# EAGLE design tiny_rack_v2_psu_exp_170 (EAGLE 9.6.2)

## Sheet 1 of 3
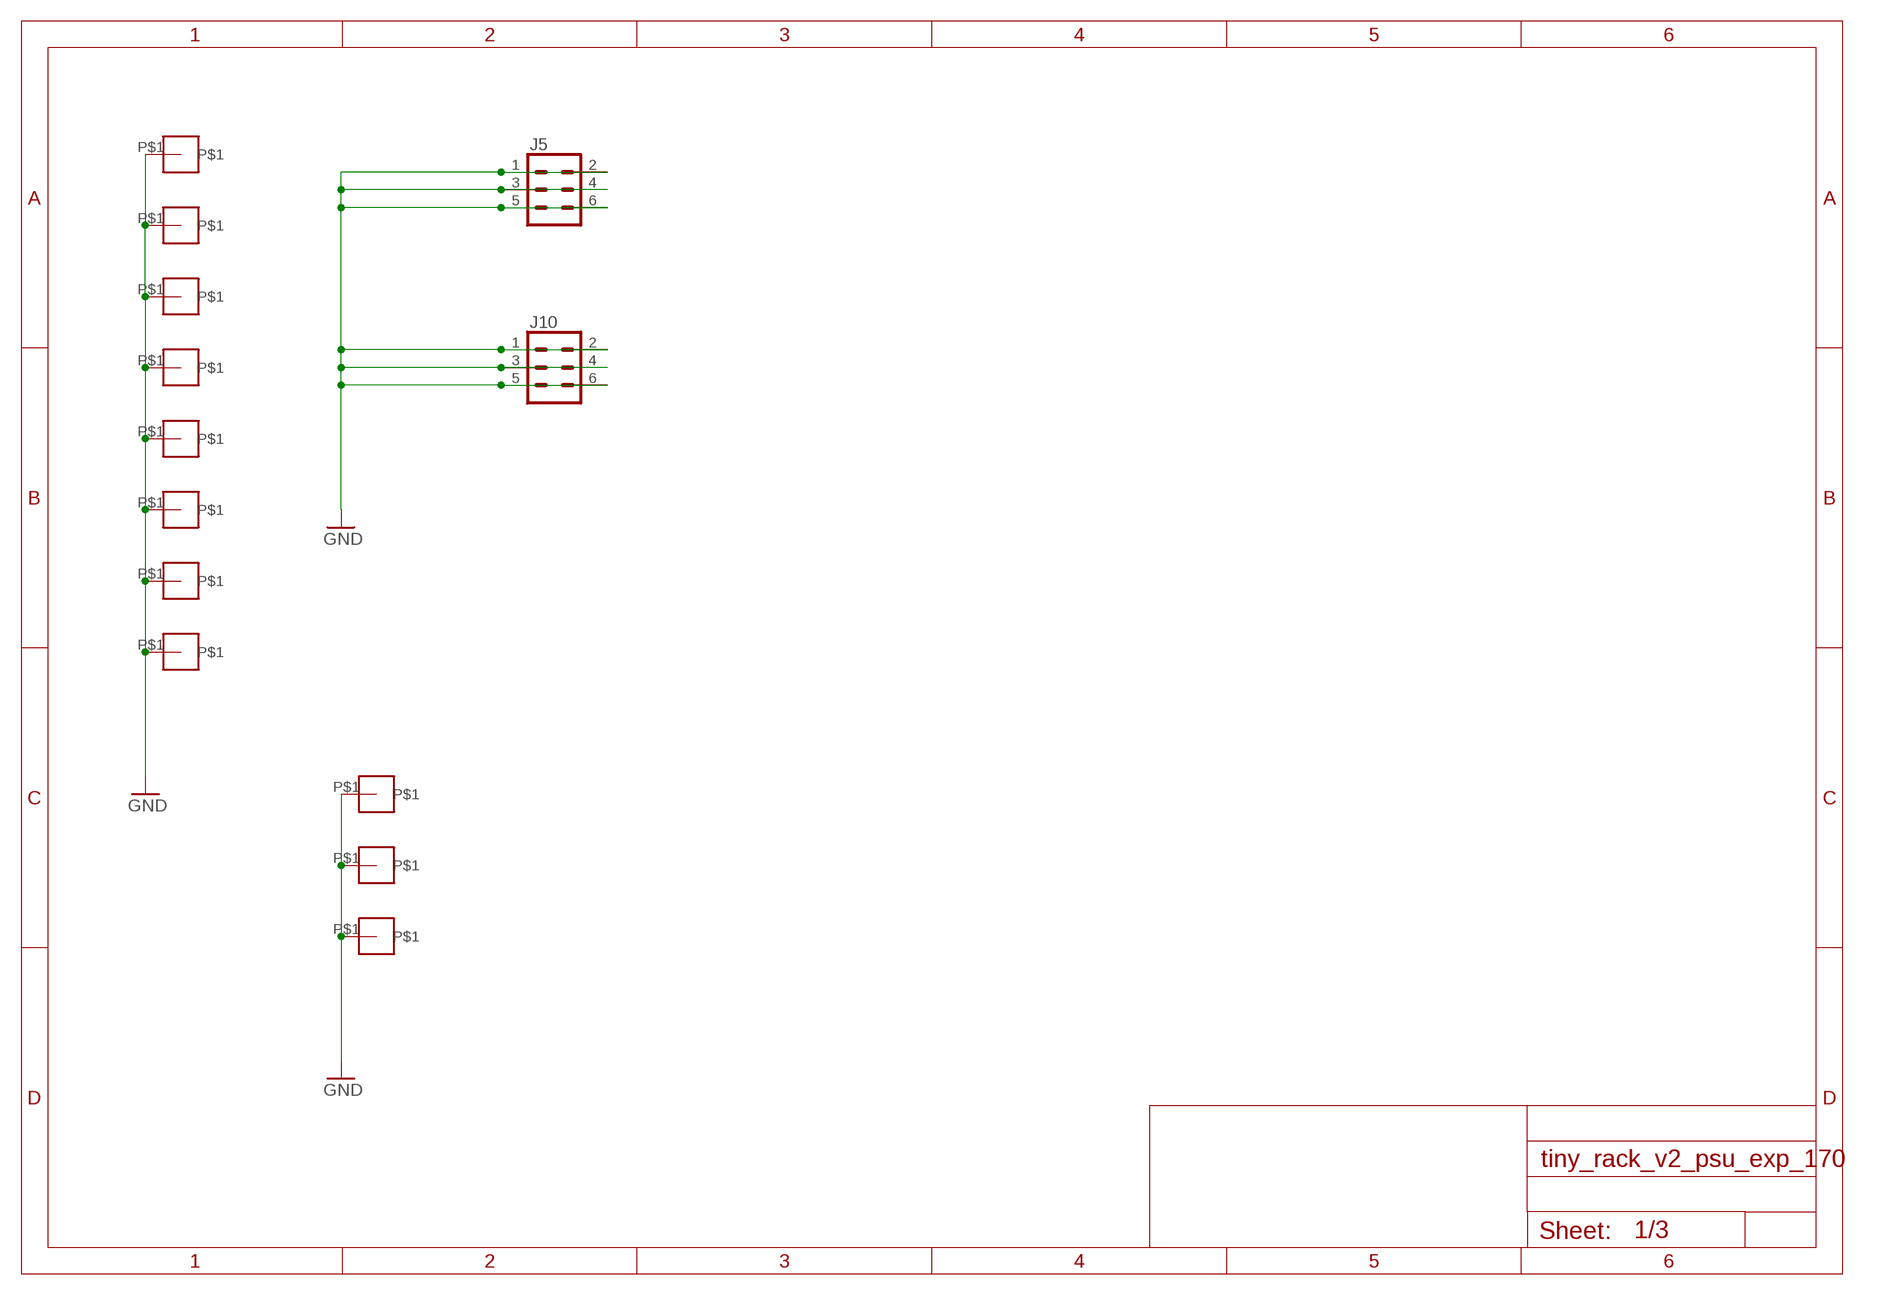
[diagram p0: schematic, sheet 1]

### Parts
J5  CONN_03X2FEMALE_SMD  [2X3_SMD]
J10  CONN_03X2FEMALE_SMD  [2X3_SMD]
U$1  M3-HOLE  [M3-HOLE]
U$2  M3-HOLE  [M3-HOLE]
U$3  M3-HOLE  [M3-HOLE]
U$4  M3-HOLE  [M3-HOLE]
U$5  M3-HOLE  [M3-HOLE]
U$6  M3-HOLE  [M3-HOLE]
U$8  M3-HOLE  [M3-HOLE]
U$9  M3-HOLE  [M3-HOLE]
U$10  M3-HOLE  [M3-HOLE]
U$11  M3-HOLE  [M3-HOLE]
U$12  M3-HOLE  [M3-HOLE]

### Nets
GND: J5.1 J5.2 J5.3 J5.4 J5.5 J5.6 J10.1 J10.2 J10.3 J10.4 J10.5 J10.6 U$1.P$1 U$2.P$1 U$3.P$1 U$4.P$1 U$5.P$1 U$6.P$1 U$8.P$1 U$9.P$1 U$10.P$1 U$11.P$1 U$12.P$1 ; also sheet 2,3

## Sheet 2 of 3
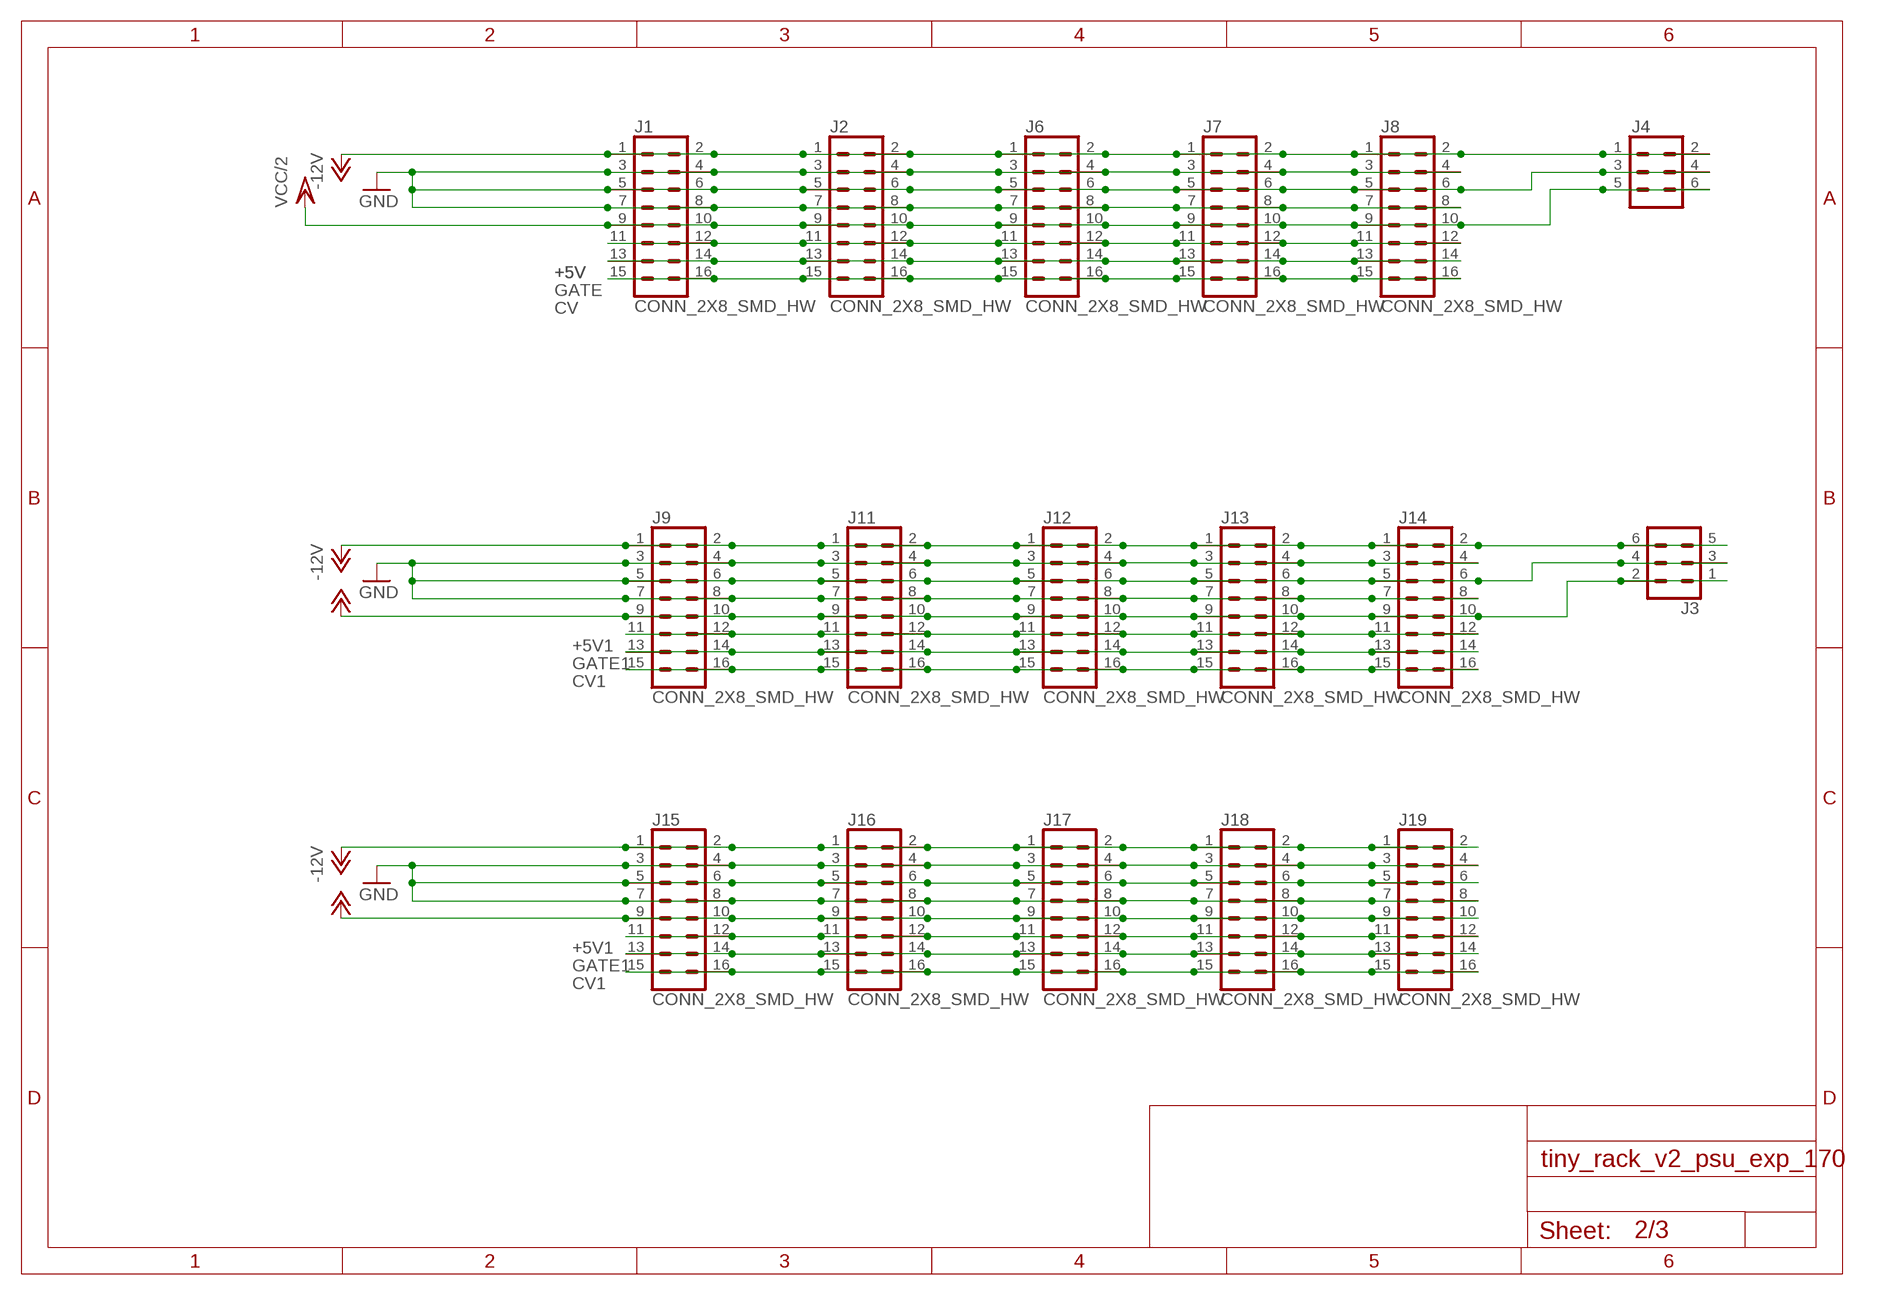
[diagram p1: schematic, sheet 2]

### Parts
J1  CONN_2X8_SMD_HW  [2X8-SHROUDED_SMD_HW]
J2  CONN_2X8_SMD_HW  [2X8-SHROUDED_SMD_HW]
J3  CONN_03X2FEMALE_SMD  [2X3_SMD]
J4  CONN_03X2FEMALE_SMD  [2X3_SMD]
J6  CONN_2X8_SMD_HW  [2X8-SHROUDED_SMD_HW]
J7  CONN_2X8_SMD_HW  [2X8-SHROUDED_SMD_HW]
J8  CONN_2X8_SMD_HW  [2X8-SHROUDED_SMD_HW]
J9  CONN_2X8_SMD_HW  [2X8-SHROUDED_SMD_HW]
J11  CONN_2X8_SMD_HW  [2X8-SHROUDED_SMD_HW]
J12  CONN_2X8_SMD_HW  [2X8-SHROUDED_SMD_HW]
J13  CONN_2X8_SMD_HW  [2X8-SHROUDED_SMD_HW]
J14  CONN_2X8_SMD_HW  [2X8-SHROUDED_SMD_HW]
J15  CONN_2X8_SMD_HW  [2X8-SHROUDED_SMD_HW]
J16  CONN_2X8_SMD_HW  [2X8-SHROUDED_SMD_HW]
J17  CONN_2X8_SMD_HW  [2X8-SHROUDED_SMD_HW]
J18  CONN_2X8_SMD_HW  [2X8-SHROUDED_SMD_HW]
J19  CONN_2X8_SMD_HW  [2X8-SHROUDED_SMD_HW]

### Nets
+5V: J1.11 J1.12 J2.11 J2.12 J6.11 J6.12 J7.11 J7.12 J8.11 J8.12 ; also sheet 3
+5V1: J9.11 J9.12 J11.11 J11.12 J12.11 J12.12 J13.11 J13.12 J14.11 J14.12 J15.11 J15.12 J16.11 J16.12 J17.11 J17.12 J18.11 J18.12 J19.11 J19.12 ; also sheet 3
+12V: J3.1 J3.2 J9.9 J9.10 J11.9 J11.10 J12.9 J12.10 J13.9 J13.10 J14.9 J14.10 J15.9 J15.10 J16.9 J16.10 J17.9 J17.10 J18.9 J18.10 J19.9 J19.10 ; also sheet 3
-12V: J1.1 J1.2 J2.1 J2.2 J3.5 J3.6 J4.1 J4.2 J6.1 J6.2 J7.1 J7.2 J8.1 J8.2 J9.1 J9.2 J11.1 J11.2 J12.1 J12.2 J13.1 J13.2 J14.1 J14.2 J15.1 J15.2 J16.1 J16.2 J17.1 J17.2 J18.1 J18.2 J19.1 J19.2 ; also sheet 3
CV: J1.15 J1.16 J2.15 J2.16 J6.15 J6.16 J7.15 J7.16 J8.15 J8.16 ; also sheet 3
CV1: J9.15 J9.16 J11.15 J11.16 J12.15 J12.16 J13.15 J13.16 J14.15 J14.16 J15.15 J15.16 J16.15 J16.16 J17.15 J17.16 J18.15 J18.16 J19.15 J19.16 ; also sheet 3
GATE: J1.13 J1.14 J2.13 J2.14 J6.13 J6.14 J7.13 J7.14 J8.13 J8.14 ; also sheet 3
GATE1: J9.13 J9.14 J11.13 J11.14 J12.13 J12.14 J13.13 J13.14 J14.13 J14.14 J15.13 J15.14 J16.13 J16.14 J17.13 J17.14 J18.13 J18.14 J19.13 J19.14 ; also sheet 3
GND: J1.3 J1.4 J1.5 J1.6 J1.7 J1.8 J2.3 J2.4 J2.5 J2.6 J2.7 J2.8 J3.3 J3.4 J4.3 J4.4 J6.3 J6.4 J6.5 J6.6 J6.7 J6.8 J7.3 J7.4 J7.5 J7.6 J7.7 J7.8 J8.3 J8.4 J8.5 J8.6 J8.7 J8.8 J9.3 J9.4 J9.5 J9.6 J9.7 J9.8 J11.3 J11.4 J11.5 J11.6 J11.7 J11.8 J12.3 J12.4 J12.5 J12.6 J12.7 J12.8 J13.3 J13.4 J13.5 J13.6 J13.7 J13.8 J14.3 J14.4 J14.5 J14.6 J14.7 J14.8 J15.3 J15.4 J15.5 J15.6 J15.7 J15.8 J16.3 J16.4 J16.5 J16.6 J16.7 J16.8 J17.3 J17.4 J17.5 J17.6 J17.7 J17.8 J18.3 J18.4 J18.5 J18.6 J18.7 J18.8 J19.3 J19.4 J19.5 J19.6 J19.7 J19.8 ; also sheet 1,3
VCC/2: J1.9 J1.10 J2.9 J2.10 J4.5 J4.6 J6.9 J6.10 J7.9 J7.10 J8.9 J8.10 ; also sheet 3

## Sheet 3 of 3
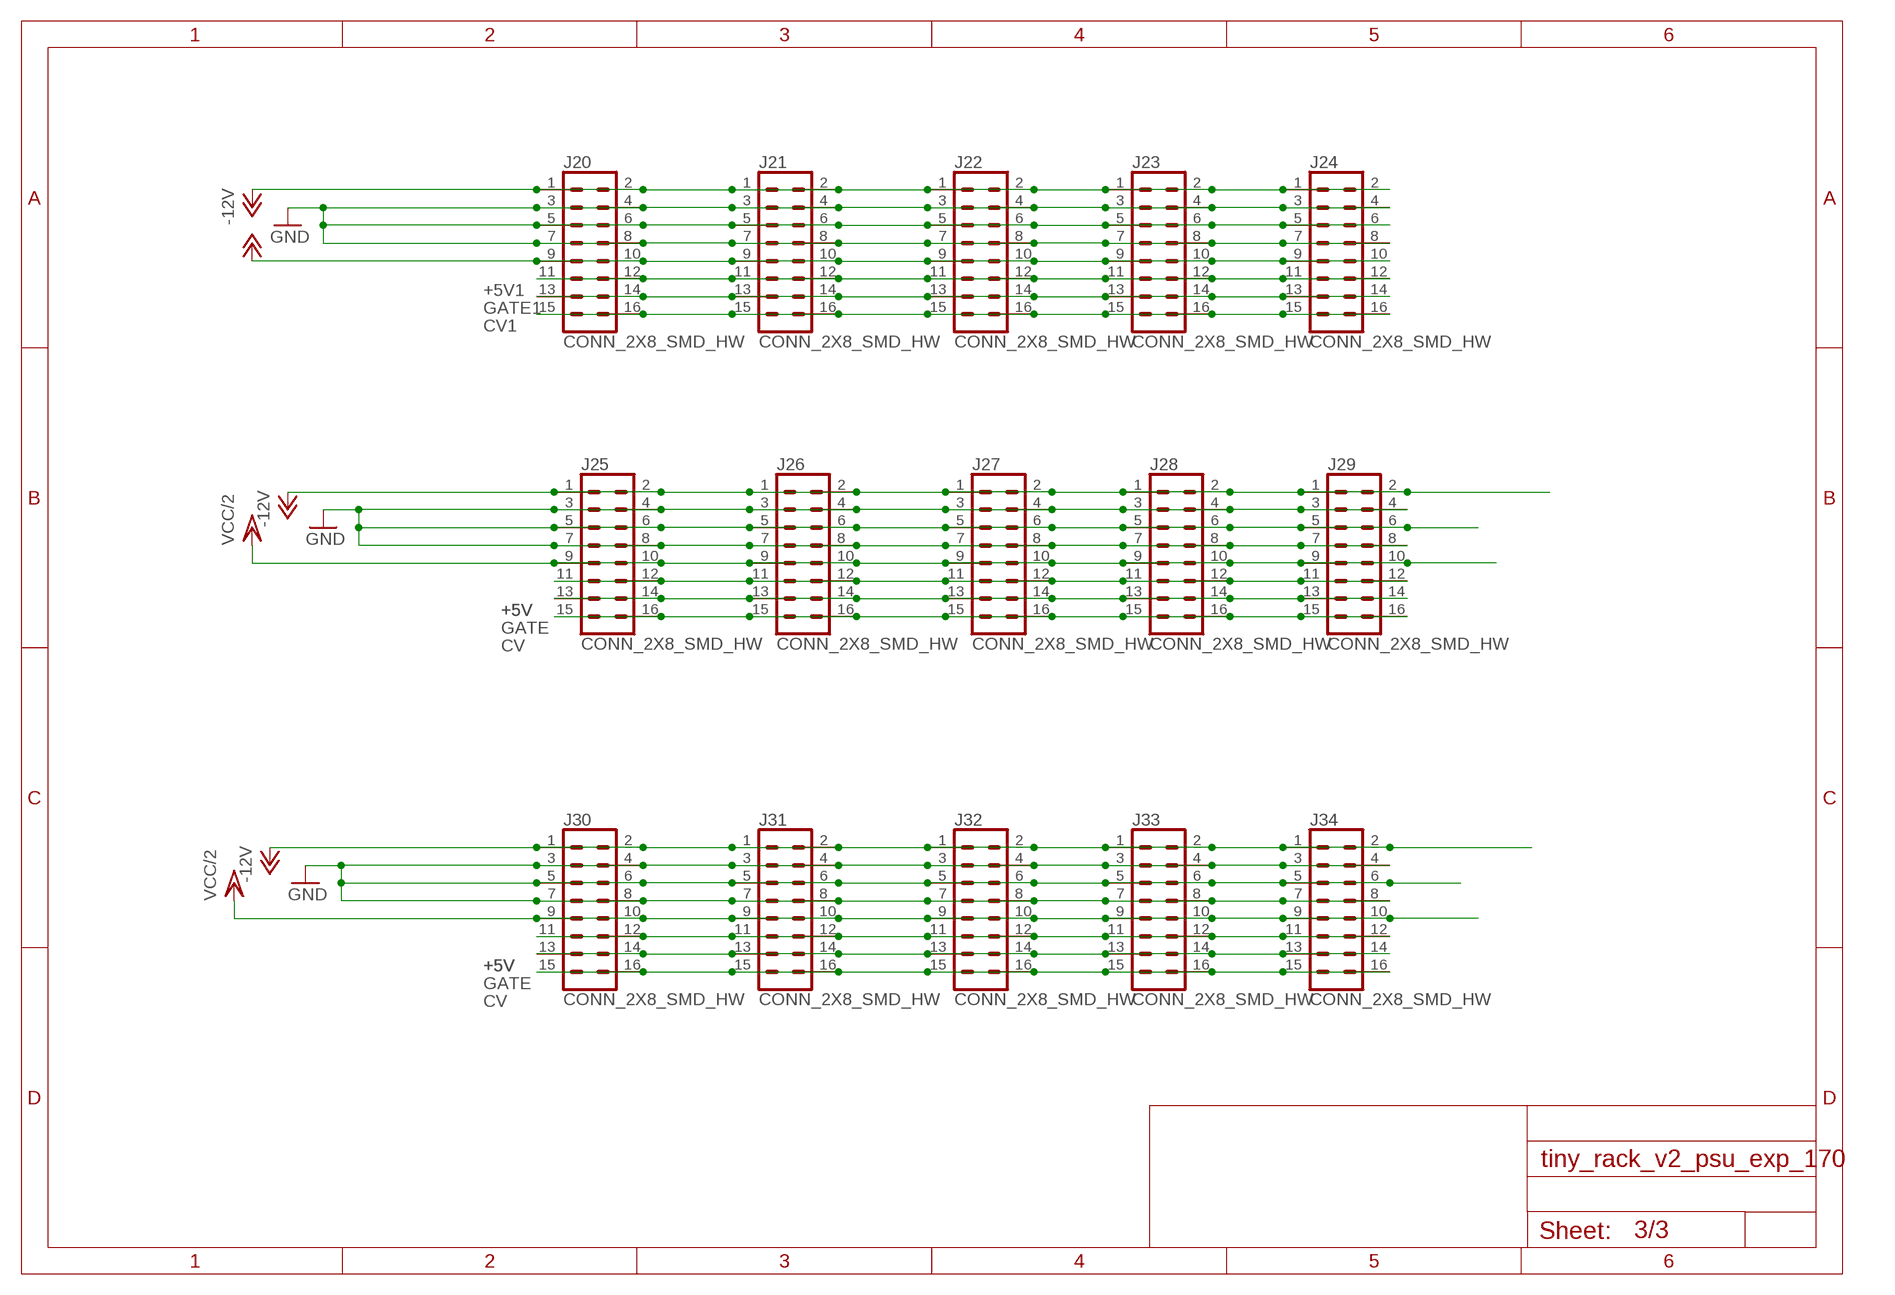
[diagram p2: schematic, sheet 3]

### Parts
J20  CONN_2X8_SMD_HW  [2X8-SHROUDED_SMD_HW]
J21  CONN_2X8_SMD_HW  [2X8-SHROUDED_SMD_HW]
J22  CONN_2X8_SMD_HW  [2X8-SHROUDED_SMD_HW]
J23  CONN_2X8_SMD_HW  [2X8-SHROUDED_SMD_HW]
J24  CONN_2X8_SMD_HW  [2X8-SHROUDED_SMD_HW]
J25  CONN_2X8_SMD_HW  [2X8-SHROUDED_SMD_HW]
J26  CONN_2X8_SMD_HW  [2X8-SHROUDED_SMD_HW]
J27  CONN_2X8_SMD_HW  [2X8-SHROUDED_SMD_HW]
J28  CONN_2X8_SMD_HW  [2X8-SHROUDED_SMD_HW]
J29  CONN_2X8_SMD_HW  [2X8-SHROUDED_SMD_HW]
J30  CONN_2X8_SMD_HW  [2X8-SHROUDED_SMD_HW]
J31  CONN_2X8_SMD_HW  [2X8-SHROUDED_SMD_HW]
J32  CONN_2X8_SMD_HW  [2X8-SHROUDED_SMD_HW]
J33  CONN_2X8_SMD_HW  [2X8-SHROUDED_SMD_HW]
J34  CONN_2X8_SMD_HW  [2X8-SHROUDED_SMD_HW]

### Nets
+5V: J25.11 J25.12 J26.11 J26.12 J27.11 J27.12 J28.11 J28.12 J29.11 J29.12 J30.11 J30.12 J31.11 J31.12 J32.11 J32.12 J33.11 J33.12 J34.11 J34.12 ; also sheet 2
+5V1: J20.11 J20.12 J21.11 J21.12 J22.11 J22.12 J23.11 J23.12 J24.11 J24.12 ; also sheet 2
+12V: J20.9 J20.10 J21.9 J21.10 J22.9 J22.10 J23.9 J23.10 J24.9 J24.10 ; also sheet 2
-12V: J20.1 J20.2 J21.1 J21.2 J22.1 J22.2 J23.1 J23.2 J24.1 J24.2 J25.1 J25.2 J26.1 J26.2 J27.1 J27.2 J28.1 J28.2 J29.1 J29.2 J30.1 J30.2 J31.1 J31.2 J32.1 J32.2 J33.1 J33.2 J34.1 J34.2 ; also sheet 2
CV: J25.15 J25.16 J26.15 J26.16 J27.15 J27.16 J28.15 J28.16 J29.15 J29.16 J30.15 J30.16 J31.15 J31.16 J32.15 J32.16 J33.15 J33.16 J34.15 J34.16 ; also sheet 2
CV1: J20.15 J20.16 J21.15 J21.16 J22.15 J22.16 J23.15 J23.16 J24.15 J24.16 ; also sheet 2
GATE: J25.13 J25.14 J26.13 J26.14 J27.13 J27.14 J28.13 J28.14 J29.13 J29.14 J30.13 J30.14 J31.13 J31.14 J32.13 J32.14 J33.13 J33.14 J34.13 J34.14 ; also sheet 2
GATE1: J20.13 J20.14 J21.13 J21.14 J22.13 J22.14 J23.13 J23.14 J24.13 J24.14 ; also sheet 2
GND: J20.3 J20.4 J20.5 J20.6 J20.7 J20.8 J21.3 J21.4 J21.5 J21.6 J21.7 J21.8 J22.3 J22.4 J22.5 J22.6 J22.7 J22.8 J23.3 J23.4 J23.5 J23.6 J23.7 J23.8 J24.3 J24.4 J24.5 J24.6 J24.7 J24.8 J25.3 J25.4 J25.5 J25.6 J25.7 J25.8 J26.3 J26.4 J26.5 J26.6 J26.7 J26.8 J27.3 J27.4 J27.5 J27.6 J27.7 J27.8 J28.3 J28.4 J28.5 J28.6 J28.7 J28.8 J29.3 J29.4 J29.5 J29.6 J29.7 J29.8 J30.3 J30.4 J30.5 J30.6 J30.7 J30.8 J31.3 J31.4 J31.5 J31.6 J31.7 J31.8 J32.3 J32.4 J32.5 J32.6 J32.7 J32.8 J33.3 J33.4 J33.5 J33.6 J33.7 J33.8 J34.3 J34.4 J34.5 J34.6 J34.7 J34.8 ; also sheet 1,2
VCC/2: J25.9 J25.10 J26.9 J26.10 J27.9 J27.10 J28.9 J28.10 J29.9 J29.10 J30.9 J30.10 J31.9 J31.10 J32.9 J32.10 J33.9 J33.10 J34.9 J34.10 ; also sheet 2

## Library data of the parts
J1 J2 J6-J9 J11-J34 = conn-fc:CONN_2X8_SMD_HW
J3-J5 J10 = SparkFun-Connectors:CONN_03X2: Multi connection point. Often used as Generic Header-pin footprint for 0.1 inch spaced/style header connections You can populate with any combo of single row headers, but if you'd like an exact match, check these: Header - 2x3 (Male, 0.1") <https://www.sparkfun.com/products/12807> (PRT-12807) Header - 2x3 (Female, 0.1") <https://www.sparkfun.com/products/13010> (PRT-13010) 2x3 Pin Shrouded Header <https://www.sparkfun.com/products/10877> (PRT-10877) On any of the 0.1 inch spaced packages, you can populate with these: Break Away Headers - Straight <https://www.sparkfun.com/products/116> (PRT-00116) Break Away Male Headers - Right Angle <https://www.sparkfun.com/products/553> (PRT-00553) Female Headers <https://www.sparkfun.com/products/115> (PRT-00115) Break Away Headers - Machine Pin <https://www.sparkfun.com/products/117> (PRT-00117) Break Away Female Headers - Swiss Machine Pin <https://www.sparkfun.com/products/743> (PRT-00743) Special note: the shrouded connector mates well with our 3x2 ribbon cables: Ribbon Crimp Connector - 6-pin (2x3, Female) <https://www.sparkfun.com/products/10651> (PRT-10651) Ribbon Cable - 6 wire (15ft) <https://www.sparkfun.com/products/10646> (PRT-10646); PROD_ID: CONN-11290
U$1-U$6 U$8-U$12 = biti:M3-HOLE

## Board
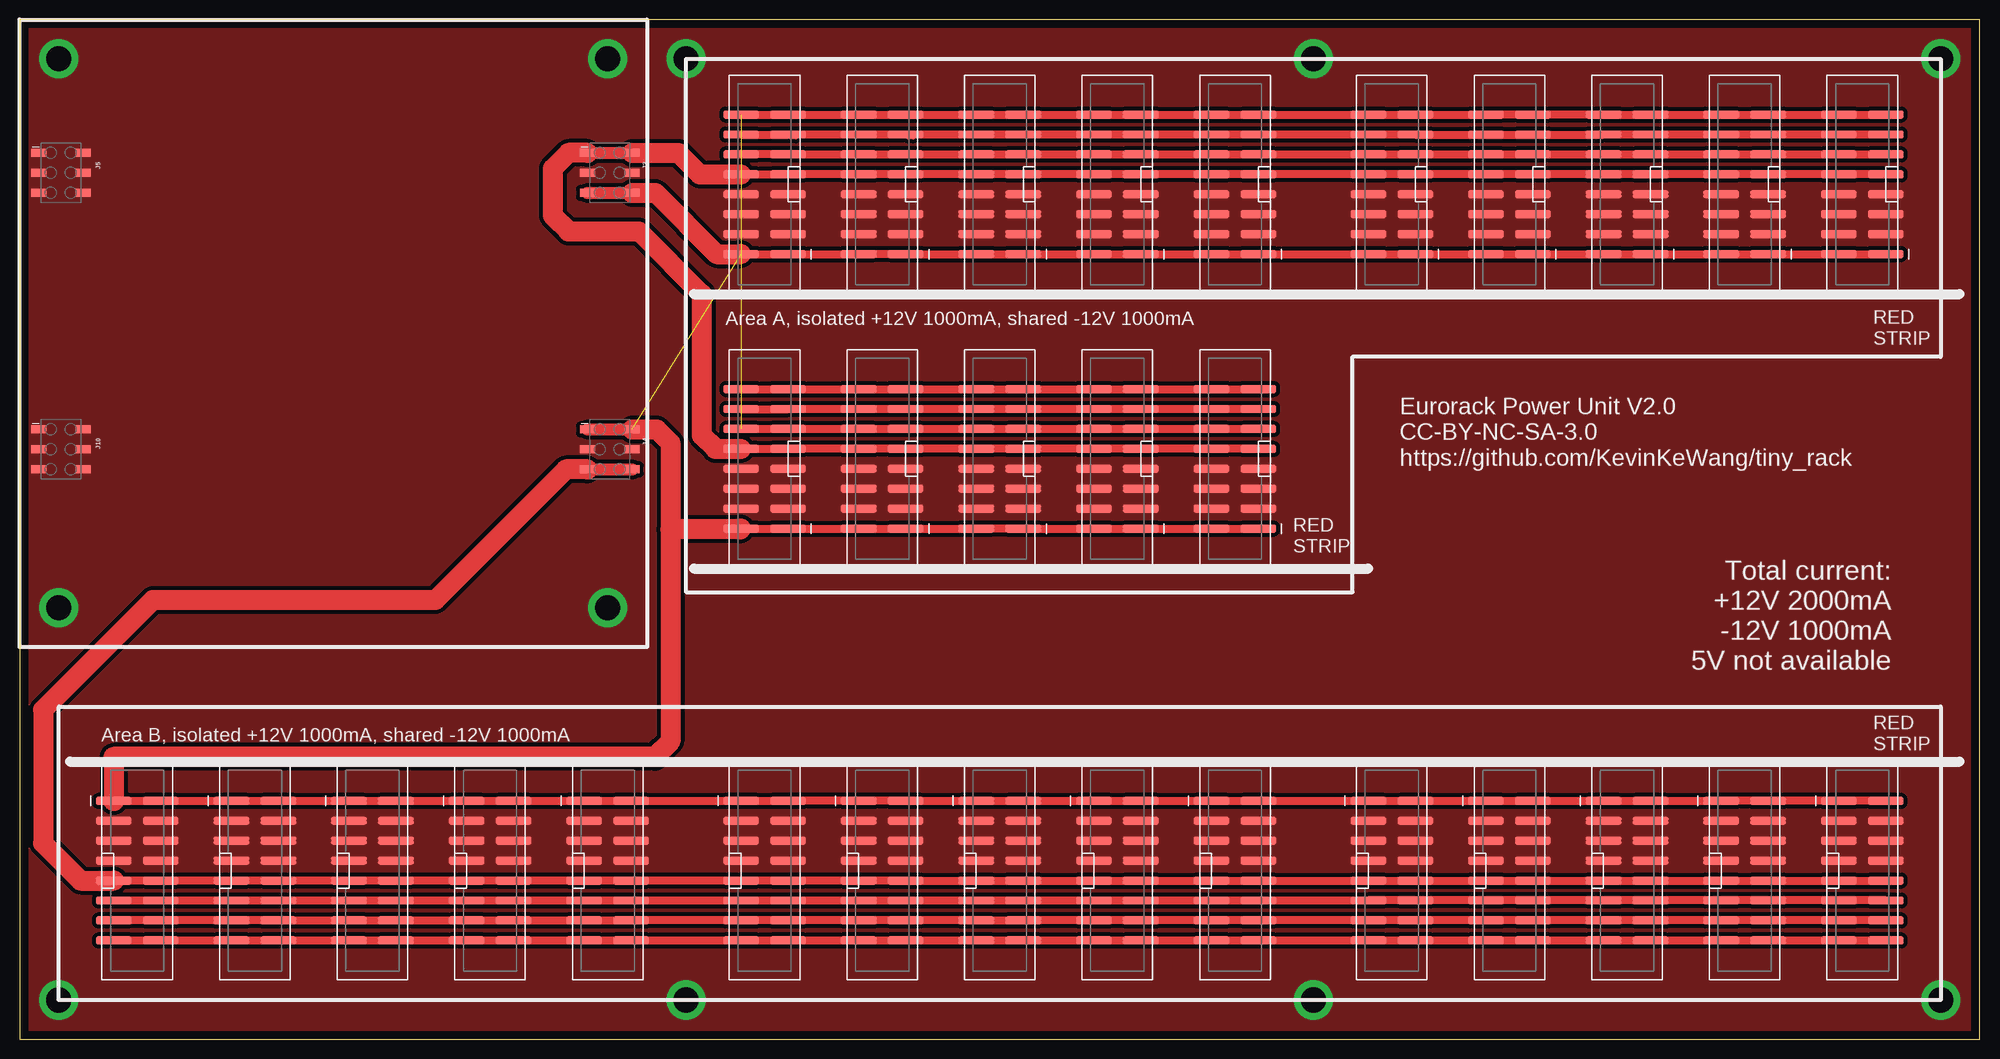
[diagram p3: board, top side]
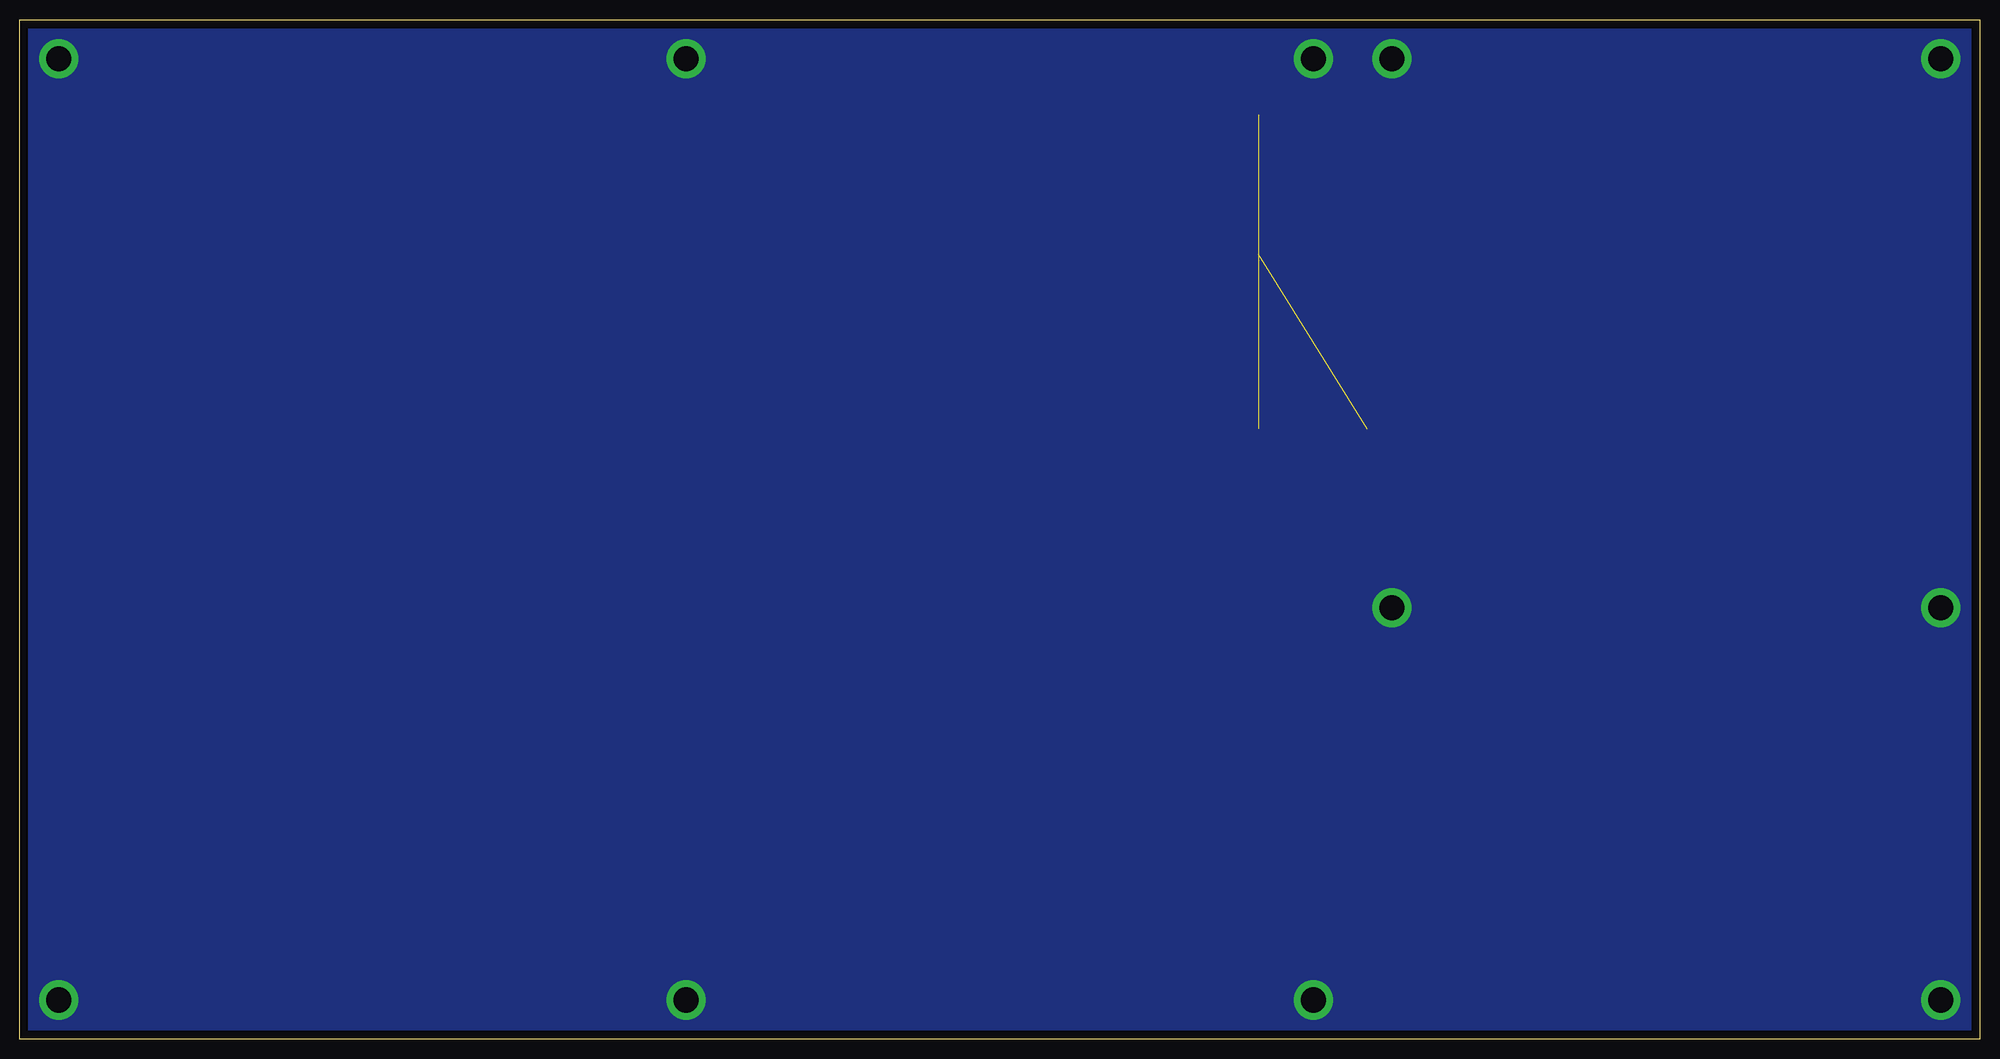
[diagram p4: board, bottom side, seen from below]

Size 250 x 130 mm. Coordinates in mm from the lower left corner, seen from the top.
Outline: 0,0 250,0 250,130 0,130 0,0
Copper layers (1+2*15+16): Top 0.035mm / dielectric 0.3mm / Route2 0.035mm / dielectric 0.75mm / Route15 0.035mm / dielectric 0.3mm / Bottom 0.035mm
Design rules "default *": minimum track width 20mil, minimum drill 0.35mm, track to track 20mil, track to pad 20mil, pad to pad 20mil, via to via 20mil, smd to smd 6mil, copper to edge 40mil, drill to drill 6mil, minimum pad ring 10mil, minimum via ring 8mil, stop-mask expansion 4mil, vias tented up to drill 0mil, thermal gap 10mil

### Footprints (pad centres in the part's own frame; a part is rotated, then mirrored left to right if it is on the bottom)
2X8-SHROUDED_SMD_HW = smd 4.55 x 1: 1 -2.994,8.89; 2 2.994,8.89; 3 -2.994,6.35; 4 2.994,6.35; 5 -2.994,3.81; 6 2.994,3.81; 7 -2.994,1.27; 8 2.994,1.27; 9 -2.994,-1.27; 10 2.994,-1.27; 11 -2.994,-3.81; 12 2.994,-3.81; 13 -2.994,-6.35; 14 2.994,-6.35; 15 -2.994,-8.89; 16 2.994,-8.89
2X3_SMD = smd 1.02 x 1.9: 1 -2.54,-2.85; 2 -2.54,2.85; 3 0,-2.85; 4 0,2.85; 5 2.54,-2.85; 6 2.54,2.85
M3-HOLE = drill 3.2 pad 5: P$1 0,0

### Placement (x,y rotation side)
J1  15,21.5 0 top
J2  30,21.5 0 top
J3  75.27,110.46 270 top
J4  75.27,75.21 270 top
J5  5.27,110.46 270 top
J6  45,21.5 0 top
J7  60,21.5 0 top
J8  75,21.5 0 top
J9  95,109 180 top
J10  5.27,75.21 270 top
J11  110,109 180 top
J12  125,109 180 top
J13  140,109 180 top
J14  155,109 180 top
J15  95,74 180 top
J16  110,74 180 top
J17  125,74 180 top
J18  140,74 180 top
J19  155,74 180 top
J20  175,109 180 top
J21  190,109 180 top
J22  205,109 180 top
J23  220,109 180 top
J24  235,109 180 top
J25  95,21.5 0 top
J26  110,21.5 0 top
J27  125,21.5 0 top
J28  140,21.5 0 top
J29  155,21.5 0 top
J30  175,21.5 0 top
J31  190,21.5 0 top
J32  205,21.5 0 top
J33  220,21.5 0 top
J34  235,21.5 0 top
U$1  5,5 0 top
U$2  5,125 0 top
U$3  85,5 0 top
U$4  85,125 0 top
U$5  165,5 0 top
U$6  165,125 0 top
U$8  245,125 0 top
U$9  245,5 0 top
U$10  75,55 0 top
U$11  5,55 0 top
U$12  75,125 0 top

### Tracks (layer width: path | path; a pad name or v marks a point on that pad's centre or on a via)
+5V
  Top 1.016: J1.11 J1.12 J2.11 J2.12 J6.11 J6.12 J7.11 J7.12 J8.11 J8.12 J25.11 J25.12 J26.11 J26.12 J27.11 J27.12 J28.11 J28.12 J29.11 J29.12 J30.11 J30.12 J31.11 J31.12 J32.11 J32.12 J33.11 J33.12 J34.11 J34.12
+5V1  (1 unrouted)
  Top 1.016: J9.12 J9.11 J11.12 J11.11 J12.12 J12.11 J13.12 J13.11 J14.12 J14.11 J20.12 J20.11 J21.12 J21.11 J22.12 J22.11 J23.12 J23.11 J24.12 J24.11 | J15.12 J15.11 J16.12 J16.11 J17.12 J17.11 J18.12 J18.11 J19.12 J19.11
+12V
  Top 1.016: J9.10 J9.9 J11.10 J11.9 J12.10 J12.9 J13.10 J13.9 J14.10 J14.9 J20.10 J20.9 J21.10 J21.9 J22.10 J22.9 J23.10 J23.9 J24.10 J24.9 | J15.10 J15.9 J16.10 J16.9 J17.10 J17.9 J18.10 J18.9 J19.10 J19.9
  Top 1.524: J3.1 J3.2
  Top 2.54: J3.2 84,113 86.73,110.27 J9.10 | J3.1 70,113 68,111 68,105 70,103 79,103 87,95 87,77 88.73,75.27 J15.10
-12V  (1 unrouted)
  Top 1.016: J1.1 J1.2 J2.1 J2.2 J6.1 J6.2 J7.1 J7.2 J8.1 J8.2 J25.1 J25.2 J26.1 J26.2 J27.1 J27.2 J28.1 J28.2 J29.1 J29.2 J30.1 J30.2 J31.1 J31.2 J32.1 J32.2 J33.1 J33.2 J34.1 J34.2 | J9.2 J9.1 J11.2 J11.1 J12.2 J12.1 J13.2 J13.1 J14.2 J14.1 J20.2 J20.1 J21.2 J21.1 J22.2 J22.1 J23.2 J23.1 J24.2 J24.1 | J15.2 J15.1 J16.2 J16.1 J17.2 J17.1 J18.2 J18.1 J19.2 J19.1
  Top 1.524: J3.5 J3.6 | J4.1 J4.2
  Top 2.54: J4.2 81.25,77.75 83,76 83,65 | J1.1 12,36 81,36 83,38 83,65 | J3.6 81.08,107.92 88.89,100.11 J9.2 | J15.2 91.9,65 83,65
CV
  Top 1.016: J1.15 J1.16 J2.15 J2.16 J6.15 J6.16 J7.15 J7.16 J8.15 J8.16 J25.15 J25.16 J26.15 J26.16 J27.15 J27.16 J28.15 J28.16 J29.15 J29.16 J30.15 J30.16 J31.15 J31.16 J32.15 J32.16 J33.15 J33.16 J34.15 J34.16
CV1  (1 unrouted)
  Top 0.508: J9.15 98.89,117.89 99,118
  Top 1.016: J9.16 98.89,117.89 | J9.15 J11.16 J11.15 J12.16 J12.15 J13.16 J13.15 J14.16 J14.15 J20.16 J20.15 J21.16 J21.15 J22.16 J22.15 J23.16 J23.15 J24.16 J24.15 | J15.16 J15.15 J16.16 J16.15 J17.16 J17.15 J18.16 J18.15 J19.16 J19.15
GATE
  Top 1.016: J34.14 J34.13 J33.14 J33.13 J32.14 J32.13 J31.14 J31.13 J30.14 J30.13 J29.14 J29.13 J28.14 J28.13 J27.14 J27.13 J26.14 J26.13 J25.14 J25.13 J8.14 J8.13 J7.14 J7.13 J6.14 J6.13 J2.14 J2.13 J1.14 J1.13
GATE1  (1 unrouted)
  Top 0.508: J9.13 98.65,115.35 99,115 98.34,115 J9.13 | J11.13 113.65,115.35 114,115 113.34,115 J11.13
  Top 1.016: J9.14 J9.13 J11.14 J11.13 J12.14 J12.13 J13.14 J13.13 J14.14 J14.13 J20.14 J20.13 J21.14 J21.13 J22.14 J22.13 J23.14 J23.13 J24.14 J24.13 | J15.14 J15.13 J16.14 J16.13 J17.14 J17.13 J18.14 J18.13 J19.14 J19.13
GND
  pour Bottom (no thermals): 0,130 250,130 250,0 0,0
  pour Top (no thermals): 0,130 250,130 250,0 0,0
VCC/2
  Top 1.016: J1.9 J1.10 J2.9 J2.10 J6.9 J6.10 J7.9 J7.10 J8.9 J8.10 J25.9 J25.10 J26.9 J26.10 J27.9 J27.10 J28.9 J28.10 J29.9 J29.10 J30.9 J30.10 J31.9 J31.10 J32.9 J32.10 J33.9 J33.10 J34.9 J34.10
  Top 1.524: J4.5 J4.6
  Top 2.54: J4.5 69.67,72.67 53,56 17,56 3,42 3,25 7.77,20.23 J1.9

### Text on the board
tNames: Area A, isolated +12V 1000mA, shared -12V 1000mA | RED / STRIP | Eurorack Power Unit V2.0 / CC-BY-NC-SA-3.0 / https://github.com/KevinKeWang/tiny_rack | RED / STRIP | Total current: / +12V 2000mA / -12V 1000mA / 5V not available | Area B, isolated +12V 1000mA, shared -12V 1000mA | RED / STRIP